# EAGLE design lime2_adapter (EAGLE 6.6.0)
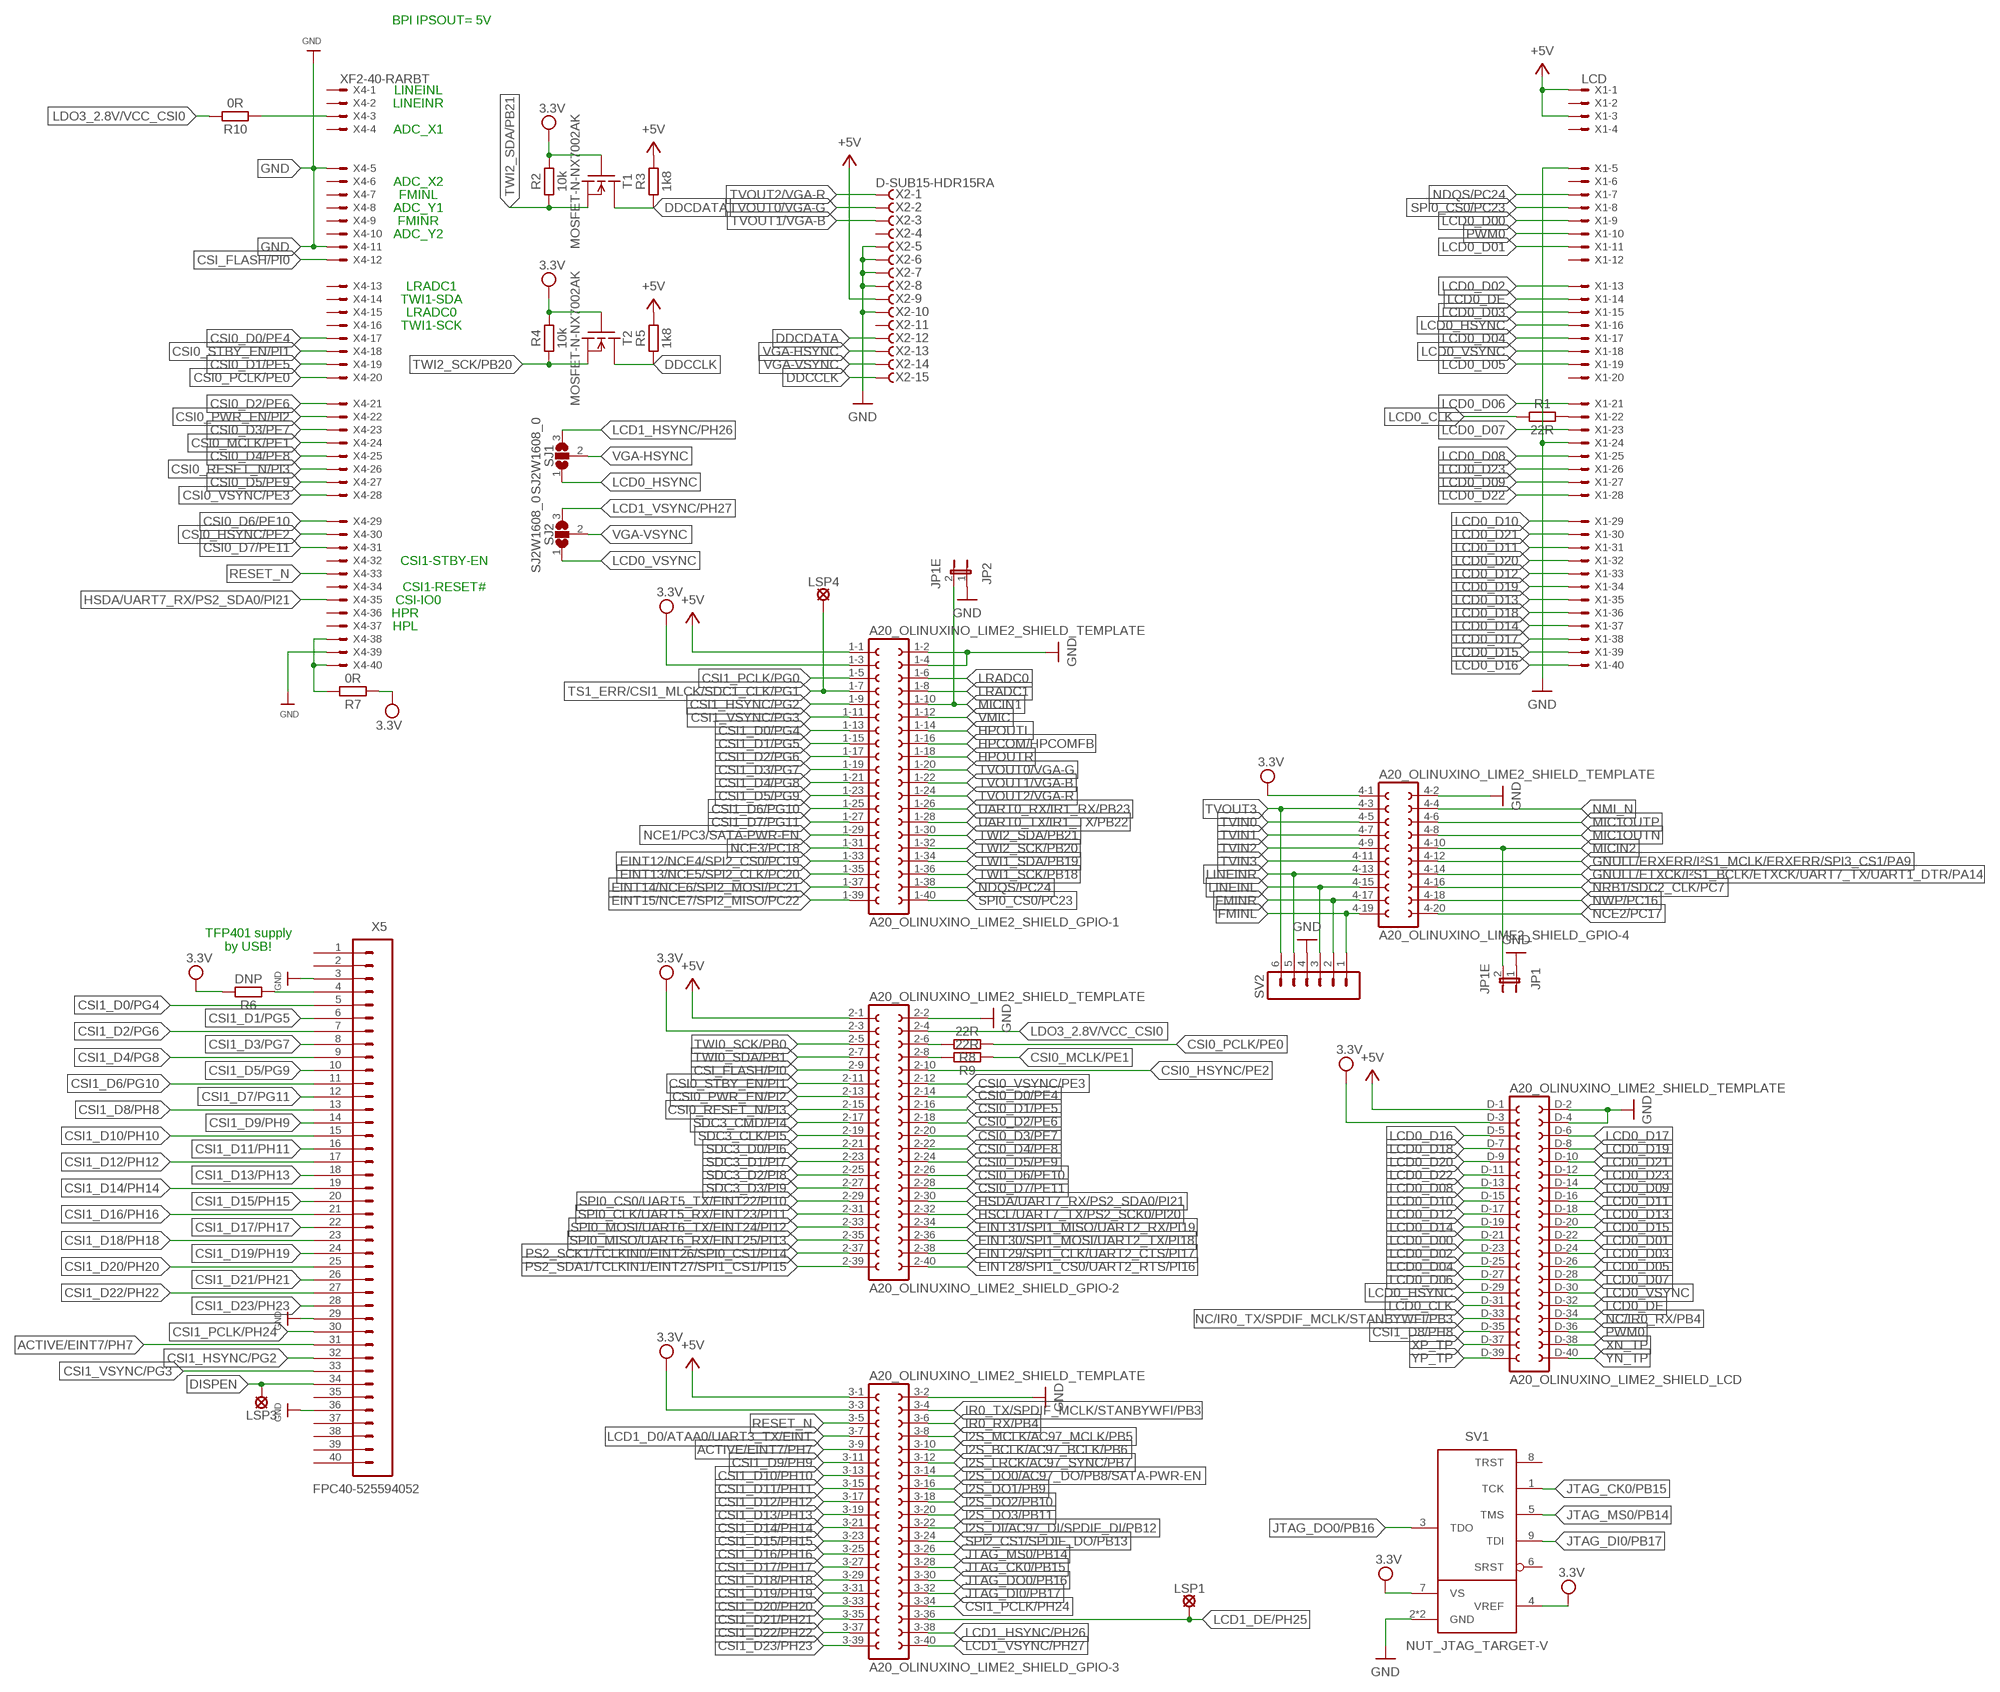
[diagram p0: schematic, sheet 1]

## Parts
A20_OLINUXINO_LIME2_SHIELD  A20_OLINUXINO_LIME2_SHIELD_TEMPLATE  [A20_OLINUXINO_LIME2_SHIELD]
JP1  JP1E  [JP1]
JP2  JP1E  [JP1]
LSP1  LSP-PAD15  [PAD15]
LSP3  LSP-PAD15  [PAD15]
LSP4  LSP-PAD15  [PAD15]
R1  22R  R-EU_RES1608X55N  [RES1608X55N]
R2  10k  R-EU_RES1608X55N  [RES1608X55N]
R3  1k8  R-EU_RES1608X55N  [RES1608X55N]
R4  10k  R-EU_RES1608X55N  [RES1608X55N]
R5  1k8  R-EU_RES1608X55N  [RES1608X55N]
R6  DNP  R-EU_RES1608X55N  [RES1608X55N]
R7  0R  R-EU_RES1608X55N  [RES1608X55N]
R8  22R  R-EU_RES1608X55N  [RES1608X55N]
R9  22R  R-EU_RES1608X55N  [RES1608X55N]
R10  0R  R-EU_RES1608X55N  [RES1608X55N]
SJ1  SJ2W1608_0  [SJ2_1608_0]
SJ2  SJ2W1608_0  [SJ2_1608_0]
SV1  NUT_JTAG_TARGET-V  [ML10]
SV2  MA06-1  [MA06-1]
T1  MOSFET-N-NX7002AK  [SOT95P230X110-3N]
T2  MOSFET-N-NX7002AK  [SOT95P230X110-3N]
X1  LCD  XF2-40-RARBT  [4-1734839-0]
X2  D-SUB15-HDR15RA  [HDR15RA]
X4  XF2-40-RARBT  [4-1734839-0]
X5  FPC40-525594052  [525594052]

## Nets
+5V: A20_OLINUXINO_LIME2_SHIELD.1-1 A20_OLINUXINO_LIME2_SHIELD.2-1 A20_OLINUXINO_LIME2_SHIELD.3-1 A20_OLINUXINO_LIME2_SHIELD.D-1 R3.2 R5.2 X1.1 X1.3 X2.9
ACTIVE/EINT7/PH7: A20_OLINUXINO_LIME2_SHIELD.3-9 X5.31
CSI0_D0/PE4: A20_OLINUXINO_LIME2_SHIELD.2-14 X4.17
CSI0_D1/PE5: A20_OLINUXINO_LIME2_SHIELD.2-16 X4.19
CSI0_D2/PE6: A20_OLINUXINO_LIME2_SHIELD.2-18 X4.21
CSI0_D3/PE7: A20_OLINUXINO_LIME2_SHIELD.2-20 X4.23
CSI0_D4/PE8: A20_OLINUXINO_LIME2_SHIELD.2-22 X4.25
CSI0_D5/PE9: A20_OLINUXINO_LIME2_SHIELD.2-24 X4.27
CSI0_D6/PE10: A20_OLINUXINO_LIME2_SHIELD.2-26 X4.29
CSI0_D7/PE11: A20_OLINUXINO_LIME2_SHIELD.2-28 X4.31
CSI0_HSYNC/PE2: A20_OLINUXINO_LIME2_SHIELD.2-10 X4.30
CSI0_MCLK/PE1: R9.1 X4.24
CSI0_PCLK/PE0: R8.1 X4.20
CSI0_PWR_EN/PI2: A20_OLINUXINO_LIME2_SHIELD.2-13 X4.22
CSI0_RESET_N/PI3: A20_OLINUXINO_LIME2_SHIELD.2-15 X4.26
CSI0_STBY_EN/PI1: A20_OLINUXINO_LIME2_SHIELD.2-11 X4.18
CSI0_VSYNC/PE3: A20_OLINUXINO_LIME2_SHIELD.2-12 X4.28
CSI1_D0/PG4: A20_OLINUXINO_LIME2_SHIELD.1-13 X5.5
CSI1_D1/PG5: A20_OLINUXINO_LIME2_SHIELD.1-15 X5.6
CSI1_D2/PG6: A20_OLINUXINO_LIME2_SHIELD.1-17 X5.7
CSI1_D3/PG7: A20_OLINUXINO_LIME2_SHIELD.1-19 X5.8
CSI1_D4/PG8: A20_OLINUXINO_LIME2_SHIELD.1-21 X5.9
CSI1_D5/PG9: A20_OLINUXINO_LIME2_SHIELD.1-23 X5.10
CSI1_D6/PG10: A20_OLINUXINO_LIME2_SHIELD.1-25 X5.11
CSI1_D7/PG11: A20_OLINUXINO_LIME2_SHIELD.1-27 X5.12
CSI1_D8/PH8: A20_OLINUXINO_LIME2_SHIELD.D-35 X5.13
CSI1_D9/PH9: A20_OLINUXINO_LIME2_SHIELD.3-11 X5.14
CSI1_D10/PH10: A20_OLINUXINO_LIME2_SHIELD.3-13 X5.15
CSI1_D11/PH11: A20_OLINUXINO_LIME2_SHIELD.3-15 X5.16
CSI1_D12/PH12: A20_OLINUXINO_LIME2_SHIELD.3-17 X5.17
CSI1_D13/PH13: A20_OLINUXINO_LIME2_SHIELD.3-19 X5.18
CSI1_D14/PH14: A20_OLINUXINO_LIME2_SHIELD.3-21 X5.19
CSI1_D15/PH15: A20_OLINUXINO_LIME2_SHIELD.3-23 X5.20
CSI1_D16/PH16: A20_OLINUXINO_LIME2_SHIELD.3-25 X5.21
CSI1_D17/PH17: A20_OLINUXINO_LIME2_SHIELD.3-27 X5.22
CSI1_D18/PH18: A20_OLINUXINO_LIME2_SHIELD.3-29 X5.23
CSI1_D19/PH19: A20_OLINUXINO_LIME2_SHIELD.3-31 X5.24
CSI1_D20/PH20: A20_OLINUXINO_LIME2_SHIELD.3-33 X5.25
CSI1_D21/PH21: A20_OLINUXINO_LIME2_SHIELD.3-35 X5.26
CSI1_D22/PH22: A20_OLINUXINO_LIME2_SHIELD.3-37 X5.27
CSI1_D23/PH23: A20_OLINUXINO_LIME2_SHIELD.3-39 X5.28
CSI1_HSYNC/PG2: A20_OLINUXINO_LIME2_SHIELD.1-9 X5.32
CSI1_PCLK/PG0: A20_OLINUXINO_LIME2_SHIELD.1-5
CSI1_PCLK/PH24: A20_OLINUXINO_LIME2_SHIELD.3-34 X5.30
CSI1_VSYNC/PG3: A20_OLINUXINO_LIME2_SHIELD.1-11 X5.33
CSI_FLASH/PI0: A20_OLINUXINO_LIME2_SHIELD.2-9 X4.12
DDCCLK: R5.1 T2.3(D) X2.15
DDCDATA: R3.1 T1.3(D) X2.12
DISPEN: LSP3.MP X5.34
EINT12/NCE4/SPI2_CS0/PC19: A20_OLINUXINO_LIME2_SHIELD.1-33
EINT13/NCE5/SPI2_CLK/PC20: A20_OLINUXINO_LIME2_SHIELD.1-35
EINT14/NCE6/SPI2_MOSI/PC21: A20_OLINUXINO_LIME2_SHIELD.1-37
EINT15/NCE7/SPI2_MISO/PC22: A20_OLINUXINO_LIME2_SHIELD.1-39
EINT28/SPI1_CS0/UART2_RTS/PI16: A20_OLINUXINO_LIME2_SHIELD.2-40
EINT29/SPI1_CLK/UART2_CTS/PI17: A20_OLINUXINO_LIME2_SHIELD.2-38
EINT30/SPI1_MOSI/UART2_TX/PI18: A20_OLINUXINO_LIME2_SHIELD.2-36
EINT31/SPI1_MISO/UART2_RX/PI19: A20_OLINUXINO_LIME2_SHIELD.2-34
FMINL: A20_OLINUXINO_LIME2_SHIELD.4-19 SV2.1
FMINR: A20_OLINUXINO_LIME2_SHIELD.4-17 SV2.2
GND: A20_OLINUXINO_LIME2_SHIELD.1-2 A20_OLINUXINO_LIME2_SHIELD.1-4 A20_OLINUXINO_LIME2_SHIELD.2-2 A20_OLINUXINO_LIME2_SHIELD.3-2 A20_OLINUXINO_LIME2_SHIELD.4-2 A20_OLINUXINO_LIME2_SHIELD.D-2 A20_OLINUXINO_LIME2_SHIELD.D-4 JP1.1 JP2.1 SV1.2(GND) SV1.10(GND) SV2.4 X1.5 X1.24 X2.5 X2.6 X2.7 X2.8 X2.10 X4.5 X4.11 X4.39 X5.3 X5.29 X5.36
GNULL/ERXERR/I²S1_MCLK/ERXERR/SPI3_CS1/PA9: A20_OLINUXINO_LIME2_SHIELD.4-12
GNULL/ETXCK/I²S1_BCLK/ETXCK/UART7_TX/UART1_DTR/PA14: A20_OLINUXINO_LIME2_SHIELD.4-14
HPCOM/HPCOMFB: A20_OLINUXINO_LIME2_SHIELD.1-16
HPOUTL: A20_OLINUXINO_LIME2_SHIELD.1-14
HPOUTR: A20_OLINUXINO_LIME2_SHIELD.1-18
HSCL/UART7_TX/PS2_SCK0/PI20: A20_OLINUXINO_LIME2_SHIELD.2-32
HSDA/UART7_RX/PS2_SDA0/PI21: A20_OLINUXINO_LIME2_SHIELD.2-30 X4.35
I2S_BCLK/AC97_BCLK/PB6: A20_OLINUXINO_LIME2_SHIELD.3-10
I2S_DI/AC97_DI/SPDIF_DI/PB12: A20_OLINUXINO_LIME2_SHIELD.3-22
I2S_DO0/AC97_DO/PB8/SATA-PWR-EN: A20_OLINUXINO_LIME2_SHIELD.3-14
I2S_DO1/PB9: A20_OLINUXINO_LIME2_SHIELD.3-16
I2S_DO2/PB10: A20_OLINUXINO_LIME2_SHIELD.3-18
I2S_DO3/PB11: A20_OLINUXINO_LIME2_SHIELD.3-20
I2S_LRCK/AC97_SYNC/PB7: A20_OLINUXINO_LIME2_SHIELD.3-12
I2S_MCLK/AC97_MCLK/PB5: A20_OLINUXINO_LIME2_SHIELD.3-8
IR0_RX/PB4: A20_OLINUXINO_LIME2_SHIELD.3-6
IR0_TX/SPDIF_MCLK/STANBYWFI/PB3: A20_OLINUXINO_LIME2_SHIELD.3-4
JTAG_CK0/PB15: A20_OLINUXINO_LIME2_SHIELD.3-28 SV1.1(TCK)
JTAG_DI0/PB17: A20_OLINUXINO_LIME2_SHIELD.3-32 SV1.9(TDI)
JTAG_DO0/PB16: A20_OLINUXINO_LIME2_SHIELD.3-30 SV1.3(TDO)
JTAG_MS0/PB14: A20_OLINUXINO_LIME2_SHIELD.3-26 SV1.5(TMS)
LCD0_CLK: A20_OLINUXINO_LIME2_SHIELD.D-31 R1.1
LCD0_CLKR: R1.2 X1.22
LCD0_D00: A20_OLINUXINO_LIME2_SHIELD.D-21 X1.9
LCD0_D01: A20_OLINUXINO_LIME2_SHIELD.D-22 X1.11
LCD0_D02: A20_OLINUXINO_LIME2_SHIELD.D-23 X1.13
LCD0_D03: A20_OLINUXINO_LIME2_SHIELD.D-24 X1.15
LCD0_D04: A20_OLINUXINO_LIME2_SHIELD.D-25 X1.17
LCD0_D05: A20_OLINUXINO_LIME2_SHIELD.D-26 X1.19
LCD0_D06: A20_OLINUXINO_LIME2_SHIELD.D-27 X1.21
LCD0_D07: A20_OLINUXINO_LIME2_SHIELD.D-28 X1.23
LCD0_D08: A20_OLINUXINO_LIME2_SHIELD.D-13 X1.25
LCD0_D09: A20_OLINUXINO_LIME2_SHIELD.D-14 X1.27
LCD0_D10: A20_OLINUXINO_LIME2_SHIELD.D-15 X1.29
LCD0_D11: A20_OLINUXINO_LIME2_SHIELD.D-16 X1.31
LCD0_D12: A20_OLINUXINO_LIME2_SHIELD.D-17 X1.33
LCD0_D13: A20_OLINUXINO_LIME2_SHIELD.D-18 X1.35
LCD0_D14: A20_OLINUXINO_LIME2_SHIELD.D-19 X1.37
LCD0_D15: A20_OLINUXINO_LIME2_SHIELD.D-20 X1.39
LCD0_D16: A20_OLINUXINO_LIME2_SHIELD.D-5 X1.40
LCD0_D17: A20_OLINUXINO_LIME2_SHIELD.D-6 X1.38
LCD0_D18: A20_OLINUXINO_LIME2_SHIELD.D-7 X1.36
LCD0_D19: A20_OLINUXINO_LIME2_SHIELD.D-8 X1.34
LCD0_D20: A20_OLINUXINO_LIME2_SHIELD.D-9 X1.32
LCD0_D21: A20_OLINUXINO_LIME2_SHIELD.D-10 X1.30
LCD0_D22: A20_OLINUXINO_LIME2_SHIELD.D-11 X1.28
LCD0_D23: A20_OLINUXINO_LIME2_SHIELD.D-12 X1.26
LCD0_DE: A20_OLINUXINO_LIME2_SHIELD.D-32 X1.14
LCD0_HSYNC: A20_OLINUXINO_LIME2_SHIELD.D-29 SJ1.1 X1.16
LCD0_VSYNC: A20_OLINUXINO_LIME2_SHIELD.D-30 SJ2.1 X1.18
LCD1_D0/ATAA0/UART3_TX/EINT: A20_OLINUXINO_LIME2_SHIELD.3-7
LCD1_DE/PH25: A20_OLINUXINO_LIME2_SHIELD.3-36 LSP1.MP
LCD1_HSYNC/PH26: A20_OLINUXINO_LIME2_SHIELD.3-38 SJ1.3
LCD1_VSYNC/PH27: A20_OLINUXINO_LIME2_SHIELD.3-40 SJ2.3
LDO3_2.8V/VCC_CSI0: A20_OLINUXINO_LIME2_SHIELD.2-4 R10.2
LINEINL: A20_OLINUXINO_LIME2_SHIELD.4-15 SV2.3
LINEINR: A20_OLINUXINO_LIME2_SHIELD.4-13 SV2.5
LRADC0: A20_OLINUXINO_LIME2_SHIELD.1-6
LRADC1: A20_OLINUXINO_LIME2_SHIELD.1-8
MIC1OUTN: A20_OLINUXINO_LIME2_SHIELD.4-8
MIC1OUTP: A20_OLINUXINO_LIME2_SHIELD.4-6
MICIN1: A20_OLINUXINO_LIME2_SHIELD.1-10 JP2.2
MICIN2: A20_OLINUXINO_LIME2_SHIELD.4-10 JP1.2
N$1: R6.1 X5.4
N$2: R7.2 X4.38 X4.40
N$3: R10.1 X4.3
N$5: A20_OLINUXINO_LIME2_SHIELD.2-6 R8.2
N$9: A20_OLINUXINO_LIME2_SHIELD.2-8 R9.2
NC/IR0_RX/PB4: A20_OLINUXINO_LIME2_SHIELD.D-34
NC/IR0_TX/SPDIF_MCLK/STANBYWFI/PB3: A20_OLINUXINO_LIME2_SHIELD.D-33
NCE1/PC3/SATA-PWR-EN: A20_OLINUXINO_LIME2_SHIELD.1-29
NCE2/PC17: A20_OLINUXINO_LIME2_SHIELD.4-20
NCE3/PC18: A20_OLINUXINO_LIME2_SHIELD.1-31
NDQS/PC24: A20_OLINUXINO_LIME2_SHIELD.1-38 X1.7
NMI_N: A20_OLINUXINO_LIME2_SHIELD.4-4
NRB1/SDC2_CLK/PC7: A20_OLINUXINO_LIME2_SHIELD.4-16
NWP/PC16: A20_OLINUXINO_LIME2_SHIELD.4-18
PS2_SCK1/TCLKIN0/EINT26/SPI0_CS1/PI14: A20_OLINUXINO_LIME2_SHIELD.2-37
PS2_SDA1/TCLKIN1/EINT27/SPI1_CS1/PI15: A20_OLINUXINO_LIME2_SHIELD.2-39
PWM0: A20_OLINUXINO_LIME2_SHIELD.D-36 X1.10
RESET_N: A20_OLINUXINO_LIME2_SHIELD.3-5 X4.33
SDC3_CLK/PI5: A20_OLINUXINO_LIME2_SHIELD.2-19
SDC3_CMD/PI4: A20_OLINUXINO_LIME2_SHIELD.2-17
SDC3_D0/PI6: A20_OLINUXINO_LIME2_SHIELD.2-21
SDC3_D1/PI7: A20_OLINUXINO_LIME2_SHIELD.2-23
SDC3_D2/PI8: A20_OLINUXINO_LIME2_SHIELD.2-25
SDC3_D3/PI9: A20_OLINUXINO_LIME2_SHIELD.2-27
SPI0_CLK/UART5_RX/EINT23/PI11: A20_OLINUXINO_LIME2_SHIELD.2-31
SPI0_CS0/PC23: A20_OLINUXINO_LIME2_SHIELD.1-40 X1.8
SPI0_CS0/UART5_TX/EINT22/PI10: A20_OLINUXINO_LIME2_SHIELD.2-29
SPI0_MISO/UART6_RX/EINT25/PI13: A20_OLINUXINO_LIME2_SHIELD.2-35
SPI0_MOSI/UART6_TX/EINT24/PI12: A20_OLINUXINO_LIME2_SHIELD.2-33
SPI2_CS1/SPDIF_DO/PB13: A20_OLINUXINO_LIME2_SHIELD.3-24
TS1_ERR/CSI1_MLCK/SDC1_CLK/PG1: A20_OLINUXINO_LIME2_SHIELD.1-7 LSP4.MP
TVIN0: A20_OLINUXINO_LIME2_SHIELD.4-5
TVIN1: A20_OLINUXINO_LIME2_SHIELD.4-7
TVIN2: A20_OLINUXINO_LIME2_SHIELD.4-9
TVIN3: A20_OLINUXINO_LIME2_SHIELD.4-11
TVOUT0/VGA-G: A20_OLINUXINO_LIME2_SHIELD.1-20 X2.2
TVOUT1/VGA-B: A20_OLINUXINO_LIME2_SHIELD.1-22 X2.3
TVOUT2/VGA-R: A20_OLINUXINO_LIME2_SHIELD.1-24 X2.1
TVOUT3: A20_OLINUXINO_LIME2_SHIELD.4-3 SV2.6
TWI0_SCK/PB0: A20_OLINUXINO_LIME2_SHIELD.2-5
TWI0_SDA/PB1: A20_OLINUXINO_LIME2_SHIELD.2-7
TWI1_SCK/PB18: A20_OLINUXINO_LIME2_SHIELD.1-36
TWI1_SDA/PB19: A20_OLINUXINO_LIME2_SHIELD.1-34
TWI2_SCK/PB20: A20_OLINUXINO_LIME2_SHIELD.1-32 R4.1 T2.2(S)
TWI2_SDA/PB21: A20_OLINUXINO_LIME2_SHIELD.1-30 R2.1 T1.2(S)
UART0_RX/IR1_RX/PB23: A20_OLINUXINO_LIME2_SHIELD.1-26
UART0_TX/IR1_TX/PB22: A20_OLINUXINO_LIME2_SHIELD.1-28
VCC: A20_OLINUXINO_LIME2_SHIELD.1-3 A20_OLINUXINO_LIME2_SHIELD.2-3 A20_OLINUXINO_LIME2_SHIELD.3-3 A20_OLINUXINO_LIME2_SHIELD.4-1 A20_OLINUXINO_LIME2_SHIELD.D-3 R2.2 R4.2 R6.2 R7.1 SV1.4(VREF) SV1.7(VS) T1.1(G) T2.1(G) ; supply symbol labelled 3.3V
VGA-HSYNC: SJ1.2 X2.13
VGA-VSYNC: SJ2.2 X2.14
VMIC: A20_OLINUXINO_LIME2_SHIELD.1-12
XN_TP: A20_OLINUXINO_LIME2_SHIELD.D-38
XP_TP: A20_OLINUXINO_LIME2_SHIELD.D-37
YN_TP: A20_OLINUXINO_LIME2_SHIELD.D-40
YP_TP: A20_OLINUXINO_LIME2_SHIELD.D-39
Unconnected: SV1.6(SRST) SV1.8(TRST) X1.2 X1.4 X1.6 X1.12 X1.20 X2.4 X2.11 X4.1 X4.2 X4.4 X4.6 X4.7 X4.8 X4.9 X4.10 X4.13 X4.14 X4.15 X4.16 X4.32 X4.34 X4.36 X4.37 X5.1 X5.2 X5.35 X5.37 X5.38 X5.39 X5.40

## Notes on the sheet
- BPI IPSOUT= 5V
- LINEINL
- LINEINR
- ADC_X1
- ADC_X2
- FMINL
- ADC_Y1
- FMINR
- ADC_Y2
- LRADC1
- TWI1-SDA
- LRADC0
- TWI1-SCK
- CSI1-STBY-EN
- CSI1-RESET#
- CSI-IO0
- HPR
- HPL
- TFP401 supply
  by USB!

## Library data of the parts
A20_OLINUXINO_LIME2_SHIELD = A10_OLinuXino_LIME_SHIELD:A20_OLINUXINO_LIME2_SHIELD_TEMPLATE
JP1 JP2 = jumper:JP1E: JUMPER
LSP1 LSP3 LSP4 = solpad:LSP
R1-R10 = rcl:R-EU_: RESISTOR, European symbol
SJ1 SJ2 = jumper:SJ2W: SMD solder JUMPER
SV1 = local:NUT_JTAG_TARGET
SV2 = con-lstb:MA06-1: PIN HEADER; OC_FARNELL: unknown; OC_NEWARK: unknown
T1 T2 = local:MOSFET-N-*?: Generic MOSFET NX7002A?: 60 V, single N-channel Trench MOSFET, 4.5 R @ 10V max, 20 V UGS with Zener, Marking: %CM NX7002B?: 60 V, single N-channel Trench MOSFET, 2.8 R @ 10V, 2.5R @5v (typ) max, 20 V UGS with Zener, Marking: %4R 2N7002(NEX):: 60 V, single N-channel Trench MOSFET, 5 R @ 10V max, 20 V UGS, Marking: 12%
X1 X4 = adafruit:XF2*-40?: OMRON FPC Connector Source : http://www.omron.com/ecb/products/pdf/fpc.pdf XF2M-4015-rev is good for connecting up 'PSP' SHARP LQ043 LCDs
X2 = con-thomas-betts:D-SUB15-: D-Subminiatur Connector Source: Electronioc Interconnects European Edition 1998; OC_FARNELL: unknown; OC_NEWARK: unknown
X5 = local:FPC40-*

## Board
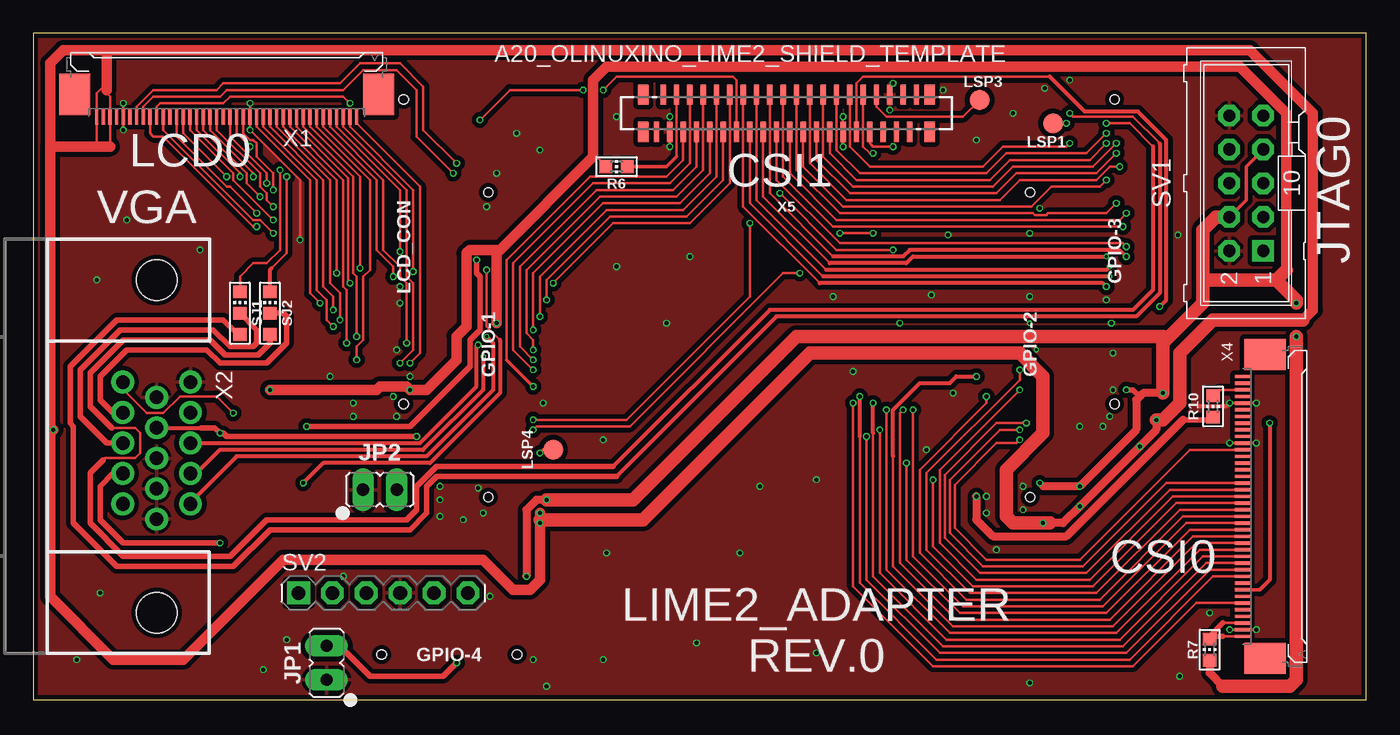
[diagram p1: board, top side]
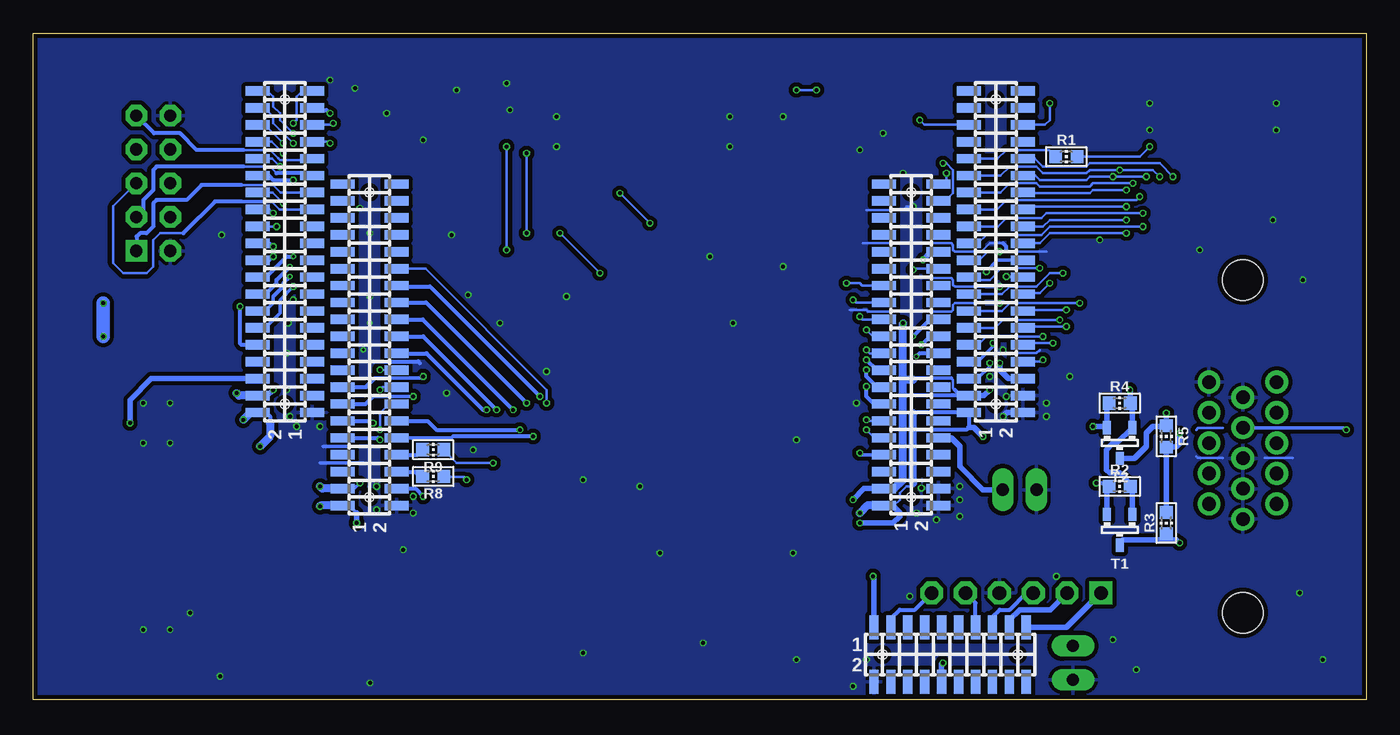
[diagram p2: board, bottom side, seen from below]

Size 100 x 50 mm. Coordinates in mm from the lower left corner, seen from the top.
Outline: 0,0 100,0 100,50 0,50 0,0
Copper layers (1*16): Top 0.035mm / dielectric 1.5mm / Bottom 0.035mm
Design rules "l100_s100_d200_2l *": minimum track width 0.1mm, minimum drill 0.2mm, track to track 0.1mm, track to pad 0.1mm, pad to pad 0.1mm, via to via 0.1mm, smd to smd 0mil, copper to edge 0.34mm, drill to drill 0.4mm, minimum pad ring 0.35mm, minimum via ring 0.1mm, stop-mask expansion 0mil, vias tented up to drill 0.299mm, thermal gap 10mil

### Footprints (pad centres in the part's own frame; a part is rotated, then mirrored left to right if it is on the bottom)
A20_OLINUXINO_LIME2_SHIELD = smd 0.7 x 1.8 bottom: 1-1 -11.874,18.352; 1-2 -11.874,22.416; 1-3 -10.604,18.352; 1-4 -10.604,22.416; 1-5 -9.335,18.352; 1-6 -9.335,22.416; 1-7 -8.065,18.352; 1-8 -8.065,22.416; 1-9 -6.795,18.352; 1-10 -6.795,22.416; 1-11 -5.524,18.352; 1-12 -5.524,22.416; 1-13 -4.255,18.352; 1-14 -4.255,22.416; 1-15 -2.985,18.352; 1-16 -2.985,22.416; 1-17 -1.714,18.352; 1-18 -1.714,22.416; 1-19 -0.445,18.352; 1-20 -0.445,22.416; 1-21 0.826,18.352; 1-22 0.826,22.416; 1-23 2.095,18.352; 1-24 2.095,22.416; 1-25 3.365,18.352; 1-26 3.365,22.416; 1-27 4.636,18.352; 1-28 4.636,22.416; 1-29 5.905,18.352; 1-30 5.905,22.416; 1-31 7.176,18.352; 1-32 7.176,22.416; 1-33 8.445,18.352; 1-34 8.445,22.416; 1-35 9.716,18.352; 1-36 9.716,22.416; 1-37 10.986,18.352; 1-38 10.986,22.416; 1-39 12.255,18.352; 1-40 12.255,22.416; 2-1 -11.874,-22.288; 2-2 -11.874,-18.224; 2-3 -10.604,-22.288; 2-4 -10.604,-18.224; 2-5 -9.335,-22.288; 2-6 -9.335,-18.224; 2-7 -8.065,-22.288; 2-8 -8.065,-18.224; 2-9 -6.795,-22.288; 2-10 -6.795,-18.224; 2-11 -5.524,-22.288; 2-12 -5.524,-18.224; 2-13 -4.255,-22.288; 2-14 -4.255,-18.224; 2-15 -2.985,-22.288; 2-16 -2.985,-18.224; 2-17 -1.714,-22.288; 2-18 -1.714,-18.224; 2-19 -0.445,-22.288; 2-20 -0.445,-18.224; 2-21 0.826,-22.288; 2-22 0.826,-18.224; 2-23 2.095,-22.288; 2-24 2.095,-18.224; 2-25 3.365,-22.288; 2-26 3.365,-18.224; 2-27 4.636,-22.288; 2-28 4.636,-18.224; 2-29 5.905,-22.288; 2-30 5.905,-18.224; 2-31 7.176,-22.288; 2-32 7.176,-18.224; 2-33 8.445,-22.288; 2-34 8.445,-18.224; 2-35 9.716,-22.288; 2-36 9.716,-18.224; 2-37 10.986,-22.288; 2-38 10.986,-18.224; 2-39 12.255,-22.288; 2-40 12.255,-18.224; 3-1 -4.889,-28.639; 3-2 -4.889,-24.575; 3-3 -3.619,-28.639; 3-4 -3.619,-24.575; 3-5 -2.349,-28.639; 3-6 -2.349,-24.575; 3-7 -1.079,-28.639; 3-8 -1.079,-24.575; 3-9 0.191,-28.639; 3-10 0.191,-24.575; 3-11 1.46,-28.639; 3-12 1.46,-24.575; 3-13 2.731,-28.639; 3-14 2.731,-24.575; 3-15 4,-28.639; 3-16 4,-24.575; 3-17 5.271,-28.639; 3-18 5.271,-24.575; 3-19 6.54,-28.639; 3-20 6.54,-24.575; 3-21 7.811,-28.639; 3-22 7.811,-24.575; 3-23 9.081,-28.639; 3-24 9.081,-24.575; 3-25 10.351,-28.639; 3-26 10.351,-24.575; 3-27 11.62,-28.639; 3-28 11.62,-24.575; 3-29 12.89,-28.639; 3-30 12.89,-24.575; 3-31 14.161,-28.639; 3-32 14.161,-24.575; 3-33 15.431,-28.639; 3-34 15.431,-24.575; 3-35 16.701,-28.639; 3-36 16.701,-24.575; 3-37 17.971,-28.639; 3-38 17.971,-24.575; 3-39 19.241,-28.639; 3-40 19.241,-24.575; D-1 -4.889,24.701; D-2 -4.889,28.765; D-3 -3.619,24.701; D-4 -3.619,28.765; D-5 -2.349,24.701; D-6 -2.349,28.765; D-7 -1.079,24.701; D-8 -1.079,28.765; D-9 0.191,24.701; D-10 0.191,28.765; D-11 1.46,24.701; D-12 1.46,28.765; D-13 2.731,24.701; D-14 2.731,28.765; D-15 4,24.701; D-16 4,28.765; D-17 5.271,24.701; D-18 5.271,28.765; D-19 6.54,24.701; D-20 6.54,28.765; D-21 7.811,24.701; D-22 7.811,28.765; D-23 9.081,24.701; D-24 9.081,28.765; D-25 10.351,24.701; D-26 10.351,28.765; D-27 11.62,24.701; D-28 11.62,28.765; D-29 12.89,24.701; D-30 12.89,28.765; D-31 14.161,24.701; D-32 14.161,28.765; D-33 15.431,24.701; D-34 15.431,28.765; D-35 16.701,24.701; D-36 16.701,28.765; D-37 17.971,24.701; D-38 17.971,28.765; D-39 19.241,24.701; D-40 19.241,28.765 | smd 1.8 x 0.7 bottom: 4-1 -21.018,17.59; 4-2 -25.082,17.59; 4-3 -21.018,18.86; 4-4 -25.082,18.86; 4-5 -21.018,20.13; 4-6 -25.082,20.13; 4-7 -21.018,21.399; 4-8 -25.082,21.399; 4-9 -21.018,22.669; 4-10 -25.082,22.669; 4-11 -21.018,23.939; 4-12 -25.082,23.939; 4-13 -21.018,25.209; 4-14 -25.082,25.209; 4-15 -21.018,26.48; 4-16 -25.082,26.48; 4-17 -21.018,27.75; 4-18 -25.082,27.75; 4-19 -21.018,29.02; 4-20 -25.082,29.02 | hole 0.7: -11.239,20.384; 11.62,20.384; -11.239,-20.256; 11.62,-20.256; -4.255,-26.607; 18.605,-26.607; -4.255,26.733; 18.605,26.733; -23.05,18.224; -23.05,28.384
JP1 = drill 0.914 long: 1 0,-1.27; 2 0,1.27
PAD15 = smd 1.5 x 1.5: MP 0,0
RES1608X55N = smd 0.95 x 1: 1 -0.8,0; 2 0.8,0
SJ2_1608_0 = smd 0.95 x 1: 1 -1.6,0; 2 0,0; 3 1.6,0
ML10 = drill 0.914 square: 1 -5.08,-1.27 | drill 0.914 octagon: 2 -5.08,1.27; 3 -2.54,-1.27; 4 -2.54,1.27; 5 0,-1.27; 6 0,1.27; 7 2.54,-1.27; 8 2.54,1.27; 9 5.08,-1.27; 10 5.08,1.27
MA06-1 = drill 1.016 square: 1 -6.35,0 | drill 1.016 octagon: 2 -3.81,0; 3 -1.27,0; 4 1.27,0; 5 3.81,0; 6 6.35,0
SOT95P230X110-3N = smd 0.6 x 1: 1 -0.95,-1.15; 2 0.95,-1.15; 3 0,1.15
4-1734839-0 = smd 0.25 x 1.1: 1 -9.75,-2.54; 2 -9.25,-2.54; 3 -8.75,-2.54; 4 -8.25,-2.54; 5 -7.75,-2.54; 6 -7.25,-2.54; 7 -6.75,-2.54; 8 -6.25,-2.54; 9 -5.75,-2.54; 10 -5.25,-2.54; 11 -4.75,-2.54; 12 -4.25,-2.54; 13 -3.75,-2.54; 14 -3.25,-2.54; 15 -2.75,-2.54; 16 -2.25,-2.54; 17 -1.75,-2.54; 18 -1.25,-2.54; 19 -0.75,-2.54; 20 -0.25,-2.54; 21 0.25,-2.54; 22 0.75,-2.54; 23 1.25,-2.54; 24 1.75,-2.54; 25 2.25,-2.54; 26 2.75,-2.54; 27 3.25,-2.54; 28 3.75,-2.54; 29 4.25,-2.54; 30 4.75,-2.54; 31 5.25,-2.54; 32 5.75,-2.54; 33 6.25,-2.54; 34 6.75,-2.54; 35 7.25,-2.54; 36 7.75,-2.54; 37 8.25,-2.54; 38 8.75,-2.54; 39 9.25,-2.54; 40 9.75,-2.54 | smd 2.3 x 3.1: M1 11.4,-0.84; M2 -11.4,-0.84
HDR15RA = drill 1.016: 1 4.318,2.54; 2 2.032,2.54; 3 -0.254,2.54; 4 -2.54,2.54; 5 -4.826,2.54; 6 5.461,0; 7 3.175,0; 8 0.889,0; 9 -1.397,0; 10 -3.683,0; 11 4.318,-2.54; 12 2.032,-2.54; 13 -0.254,-2.54; 14 -2.54,-2.54; 15 -4.826,-2.54 | hole 3.048: -12.497,0; 12.497,0
525594052 = smd 0.4 x 1.5: 1 -9.75,-1.4; 2 -9.25,1.4; 3 -8.75,-1.4; 4 -8.25,1.4; 5 -7.75,-1.4; 6 -7.25,1.4; 7 -6.75,-1.4; 8 -6.25,1.4; 9 -5.75,-1.4; 10 -5.25,1.4; 11 -4.75,-1.4; 12 -4.25,1.4; 13 -3.75,-1.4; 14 -3.25,1.4; 15 -2.75,-1.4; 16 -2.25,1.4; 17 -1.75,-1.4; 18 -1.25,1.4; 19 -0.75,-1.4; 20 -0.25,1.4; 21 0.25,-1.4; 22 0.75,1.4; 23 1.25,-1.4; 24 1.75,1.4; 25 2.25,-1.4; 26 2.75,1.4; 27 3.25,-1.4; 28 3.75,1.4; 29 4.25,-1.4; 30 4.75,1.4; 31 5.25,-1.4; 32 5.75,1.4; 33 6.25,-1.4; 34 6.75,1.4; 35 7.25,-1.4; 36 7.75,1.4; 37 8.25,-1.4; 38 8.75,1.4; 39 9.25,-1.4; 40 9.75,1.4 | smd 0.8 x 1.5: S1 10.75,1.4; S2 -10.75,1.4; S3 -10.75,-1.4; S4 10.75,-1.4

### Placement (x,y rotation side)
A20_OLINUXINO_LIME2_SHIELD  54.52,26.43 90 top
JP1  22,2.75 0 top
JP2  26,15.75 270 top
LSP1  76.5,43.25 90 top
LSP3  71,45 90 top
LSP4  39,18.75 90 top
R1  22.5,40.75 0 bottom
R2  18.5,16 0 bottom
R3  15,13.25 90 bottom
R4  18.5,22.25 0 bottom
R5  15,19.75 270 bottom
R6  43.75,40 180 top
R7  88.25,3.75 90 top
R8  70,16.75 180 bottom
R9  70,18.75 180 bottom
R10  88.5,22 270 top
SJ1  15.5,29 270 top
SJ2  17.75,29 270 top
SV1  91,38.75 90 top
SV2  26.25,8 0 top
T1  18.5,12.75 180 bottom
T2  18.5,19.25 180 bottom
X1  14.5,46.25 0 top
X2  9.25,19 270 top
X4  93.25,14.5 270 top
X5  56.5,44 0 top

### Tracks (layer width: path | path; a pad name or v marks a point on that pad's centre or on a via)
+5V  (via drill 0.3)
  Top 0.2: 4.75,41.5 X1.1 4.75,45.5 5.25,46 | 5.75,41.5 X1.3 5.75,45.25 5.25,45.75
  Top 0.3: X2.9 12.6,20.4
  Top 0.4: v28.75,19.75 14.5,19.75 14.25,20 v14,20 13.6,20.4 12.6,20.4
  Top 0.6: v84.25,21 84.25,20.25 v83,19 v78.5,14.5 77.25,13.25 76.25,13.25 | 76,13.25 v75.75,13.25
  Top 0.8: 95.25,28.5 96,29.25 96,44 91.25,48.75 5.5,48.75 | 5.5,45.75 5.5,48.75 | 5.5,48.75 2.25,48.75 1.25,47.75 1.25,41.5 | 1.25,41.5 4.75,41.5 5.75,41.5 | v38,14 38,13.5 v38,13.25 38,9 37.25,8.25 36,8.25 33.75,10.5 18.75,10.5 11.25,3 6,3 1.25,7.75 1.25,20.25 | v1.5,20.25 1.25,20.25 | 1.25,20.25 1.25,41.5
  Top 1: v84.25,21 84.75,21 86,22.25 86,26 88.5,28.5 95.25,28.5 | 38,13.5 45.75,13.5 58.25,26 74,26 75.75,24.25 75.75,20 73,17.25 73,13.75 73.5,13.25 76,13.25 76.25,13.25
  Bottom 0.2: A20_OLINUXINO_LIME2_SHIELD.1-1 35.91,14.56 35.44,14.56 35,15 35,15.5 34.5,16 34.25,16 34,16.25
  Bottom 0.25: X2.9 1.65,20.4 v1.5,20.25 | A20_OLINUXINO_LIME2_SHIELD.2-1 76.31,14.56 75.75,14
  Bottom 0.3: 34,21.5 33.96,21.54 A20_OLINUXINO_LIME2_SHIELD.D-1 29.82,20.43 30,20.25 34,20.25 | A20_OLINUXINO_LIME2_SHIELD.3-1 82.54,21.54 82.25,21.25 82.25,20.75
  Bottom 0.4: 29.82,20.43 29.43,20.43 v28.75,19.75 | R3.2 R5.2 14.3,18.95 14,19.25 v14,20 | 75.75,14 v75.75,13.25 | 35.91,14.56 35.56,14.56 35,14 35,13.75 35.5,13.25 v38,13.25
  Bottom 0.6: 34,16.25 34,20.25 34,21.5 | A20_OLINUXINO_LIME2_SHIELD.3-1 83.71,21.54 v84.25,21 | A20_OLINUXINO_LIME2_SHIELD.1-1 37.44,14.56 v38,14 | A20_OLINUXINO_LIME2_SHIELD.2-1 78.44,14.56 v78.5,14.5 | 82.25,20.75 82.25,19.75 v83,19
ACTIVE/EINT7/PH7  (via drill 0.3)
  Top 0.2: X5.31 61.75,46.25 62.25,46.75 76.25,46.75
  Top 0.3: v84.5,29.5 85,30 85,42 82.88,44.12 78.88,44.12 76.25,46.75
  Bottom 0.3: A20_OLINUXINO_LIME2_SHIELD.3-9 84.37,26.62 84.5,26.75 v84.5,29.5
CSI0_D0/PE4  (via drill 0.3)
  Top 0.2: X4.17 85,16.25 78.75,10 71.25,10 68.75,12.5 68.75,16.5 72.5,20.25 v74,20.25
  Bottom 0.2: A20_OLINUXINO_LIME2_SHIELD.2-14 73.33,22.18 74,21.5 v74,20.25
CSI0_D1/PE5  (via drill 0.3)
  Top 0.2: X4.19 85.5,15.25 79.25,9 70.75,9 68,11.75 68,17.25 v74,23.25
  Bottom 0.2: A20_OLINUXINO_LIME2_SHIELD.2-16 73.81,23.45 v74,23.25
CSI0_D2/PE6  (via drill 0.3)
  Top 0.2: X4.21 86,14.25 79.75,8 70.25,8 67,11.25 67,17 74,24 v74,24.75
  Bottom 0.2: A20_OLINUXINO_LIME2_SHIELD.2-18 73.97,24.71 v74,24.75
CSI0_D3/PE7  (via drill 0.3)
  Top 0.2: X4.23 86.5,13.25 80.25,7 69.75,7 66,10.75 v66,21.75
  Bottom 0.3: A20_OLINUXINO_LIME2_SHIELD.2-20 70.49,25.98 | 70.49,25.98 70.5,26 | 70.49,25.98 66.25,21.75 v66,21.75
CSI0_D4/PE8  (via drill 0.3)
  Top 0.2: X4.25 87,12.25 80.75,6 69.25,6 65,10.25 65,21.5 v65.25,21.75
  Bottom 0.3: A20_OLINUXINO_LIME2_SHIELD.2-22 70.75,27.26 v65.25,21.75
CSI0_D5/PE9  (via drill 0.3)
  Top 0.2: X4.27 87.5,11.25 81.25,5 68.75,5 64,9.75 v64,21.75
  Bottom 0.3: A20_OLINUXINO_LIME2_SHIELD.2-24 70.78,28.53 v64,21.75
CSI0_D6/PE10  (via drill 0.3)
  Top 0.2: X4.29 88,10.25 81.75,4 68.25,4 63,9.25 63,20
  Top 0.3: 63,20 v63,22.25
  Bottom 0.3: A20_OLINUXINO_LIME2_SHIELD.2-26 70.55,29.8 v63,22.25
CSI0_D7/PE11  (via drill 0.3)
  Top 0.2: X4.31 88.5,9.25 82.25,3 67.75,3 62,8.75 62,19.75
  Top 0.3: 62,19.75 v62,22.75
  Bottom 0.3: A20_OLINUXINO_LIME2_SHIELD.2-28 72.57,31.07 72.5,31 70.25,31 v62,22.75
CSI0_HSYNC/PE2  (via drill 0.3)
  Top 0.2: X4.30 88.25,9.75 82,3.5 68,3.5 62.5,9 v62.5,19.75
  Bottom 0.25: A20_OLINUXINO_LIME2_SHIELD.2-10 68.61,19.64 68.5,19.75
  Bottom 0.3: v62.5,19.75 68.5,19.75
CSI0_MCLK/PE1  (via drill 0.3)
  Top 0.2: X4.24 86.75,12.75 80.5,6.5 69.5,6.5 65.5,10.5 v65.5,17.75
  Bottom 0.2: R9.1 69.2,18.7 68.25,17.75 v65.5,17.75
CSI0_PCLK/PE0  (via drill 0.3)
  Top 0.2: X4.20 85.75,14.75 79.5,8.5 70.5,8.5 67.5,11.5 v67.5,16.5
  Bottom 0.2: R8.1 69.2,16.7 67.7,16.7 v67.5,16.5
CSI0_PWR_EN/PI2  (via drill 0.3)
  Top 0.2: X4.22 86.25,13.75 80,7.5 70,7.5 66.5,11 66.5,17.25 71.5,22.25 v71.5,22.75
  Bottom 0.25: 74.5,22.75 v71.5,22.75
  Bottom 0.3: A20_OLINUXINO_LIME2_SHIELD.2-13 75.08,22.18 74.5,22.75
CSI0_RESET_N/PI3  (via drill 0.3)
  Top 0.2: X4.26 87.25,11.75 81,5.5 69,5.5 64.5,10 64.5,18.25
  Top 0.3: 64.5,18.25 64.5,21.75 66.5,23.75 68.75,23.75 69.25,24.25 v70.75,24.25
  Bottom 0.25: 74.38,24.12 70.88,24.12 v70.75,24.25
  Bottom 0.3: A20_OLINUXINO_LIME2_SHIELD.2-15 75.06,23.45 74.38,24.12
CSI0_STBY_EN/PI1  (via drill 0.3)
  Top 0.2: X4.18 85.25,15.75 79,9.5 71,9.5 68.38,12.12 68.38,16.88 72.25,20.75 v74.5,20.75
  Bottom 0.3: A20_OLINUXINO_LIME2_SHIELD.2-11 74.66,20.91 v74.5,20.75
CSI0_VSYNC/PE3  (via drill 0.3)
  Top 0.2: X4.28 87.75,10.75 81.5,4.5 68.5,4.5 63.5,9.5 v63.5,20.25
  Bottom 0.3: A20_OLINUXINO_LIME2_SHIELD.2-12 70.41,20.91 69.75,20.25 v63.5,20.25
CSI1_D0/PG4  (via drill 0.3)
  Top 0.2: 35.5,25.5 35.5,33 41.75,39.25 47.5,39.25 48.75,40.5 X5.5
  Top 0.25: 35.5,25.5 v37.5,23.5
  Bottom 0.25: A20_OLINUXINO_LIME2_SHIELD.1-13 36.67,22.18
  Bottom 0.3: 36.67,22.18 36.92,22.18 37.5,22.75 v37.5,23.5
CSI1_D1/PG5  (via drill 0.3)
  Top 0.2: v37.5,24.75 36,26.25 36,32.75 42,38.75 47.75,38.75 49.25,40.25 X5.6
  Bottom 0.3: A20_OLINUXINO_LIME2_SHIELD.1-15 36.7,23.45 37.5,24.25 v37.5,24.75
CSI1_D2/PG6  (via drill 0.3)
  Top 0.2: v37.5,25.5 36.5,26.5 36.5,32.5 42.25,38.25 48,38.25 49.75,40 X5.7
  Bottom 0.3: A20_OLINUXINO_LIME2_SHIELD.1-17 36.72,24.71 v37.5,25.5
CSI1_D3/PG7  (via drill 0.3)
  Top 0.2: v37.5,26.25 37.5,27 37,27.5 37,32.25 42.5,37.75 48.25,37.75 50.25,39.75 X5.8
  Bottom 0.2: A20_OLINUXINO_LIME2_SHIELD.1-19 37.24,25.98 v37.5,26.25
CSI1_D4/PG8  (via drill 0.3)
  Top 0.2: v37.5,27.75 37.5,32 42.75,37.25 48.5,37.25 50.75,39.5 X5.9
  Bottom 0.2: A20_OLINUXINO_LIME2_SHIELD.1-21 37.01,27.26 v37.5,27.75
CSI1_D5/PG9  (via drill 0.3)
  Top 0.2: v38,28.75 38,31.75 43,36.75 48.75,36.75 51.25,39.25 X5.10
  Bottom 0.2: A20_OLINUXINO_LIME2_SHIELD.1-23 37.78,28.53 v38,28.75
CSI1_D6/PG10  (via drill 0.3)
  Top 0.2: v38.5,30 38.5,31.5 43.25,36.25 49,36.25 51.75,39 X5.11
  Bottom 0.2: A20_OLINUXINO_LIME2_SHIELD.1-25 38.3,29.8 v38.5,30
CSI1_D7/PG11  (via drill 0.3)
  Top 0.2: v39,31.25 43.5,35.75 49.25,35.75 52.25,38.75 X5.12
  Bottom 0.2: A20_OLINUXINO_LIME2_SHIELD.1-27 37.82,31.07 38,31.25 v39,31.25
CSI1_D8/PH8  (via drill 0.3)
  Top 0.2: v42.75,45.75 43.75,46.75 52.5,46.75 52.75,46.5 X5.13 | v33.5,43.5 35.75,45.75 v41.25,45.75
  Bottom 0.2: v42.75,45.75 v41.25,45.75 | A20_OLINUXINO_LIME2_SHIELD.D-35 33.13,43.13 v33.5,43.5
CSI1_D9/PH9  (via drill 0.3)
  Top 0.2: 59,31.25 53.25,37 X5.14
  Top 0.3: 59,31.25 80.25,31.25 v80.5,31
  Bottom 0.2: A20_OLINUXINO_LIME2_SHIELD.3-11 82.61,27.89
  Bottom 0.25: 82.61,27.89 81.5,29 81.5,30 v80.5,31
CSI1_D10/PH10  (via drill 0.2)
  Top 0.2: 59.25,31.75 53.75,37.25 X5.15
  Top 0.25: 80.5,31.75 v80.75,31.75
  Top 0.3: 80.5,31.75 59.25,31.75
  Bottom 0.25: A20_OLINUXINO_LIME2_SHIELD.3-13 82.59,29.16 82,29.75 82,30.25
  Bottom 0.3: v80.75,31.75 81.25,31.25 81.25,31 82,30.25
CSI1_D11/PH11  (via drill 0.2)
  Top 0.2: 59.5,32.25 54.25,37.5 X5.16
  Top 0.3: 59.5,32.25 80.5,32.25 v80.75,32.5
  Bottom 0.3: A20_OLINUXINO_LIME2_SHIELD.3-15 82.57,30.43 81.75,31.25 81.75,31.5 v80.75,32.5
CSI1_D12/PH12  (via drill 0.2)
  Top 0.2: 59.75,32.75 54.75,37.75 X5.17
  Top 0.3: 59.75,32.75 65.5,32.75 66,33.25 v80.5,33.25
  Bottom 0.3: A20_OLINUXINO_LIME2_SHIELD.3-17 82.55,31.7 81,33.25 v80.5,33.25
CSI1_D13/PH13  (via drill 0.3)
  Top 0.2: 60,33.25 55.25,38 X5.18
  Top 0.25: 81,33.75 81.5,33.75 v82,33.25
  Top 0.3: 81,33.75 65.75,33.75 65.25,33.25 60,33.25
  Bottom 0.25: A20_OLINUXINO_LIME2_SHIELD.3-19 82.28,32.97 v82,33.25
CSI1_D14/PH14  (via drill 0.3)
  Top 0.2: v82,34 81.75,34.25 60.5,34.25 55.75,39 X5.19
  Bottom 0.2: v82.01,33.99 v82,34 82.24,34.24 A20_OLINUXINO_LIME2_SHIELD.3-21
CSI1_D15/PH15  (via drill 0.3)
  Top 0.2: v81.75,35.5 60,35.5 56.25,39.25 X5.20
  Bottom 0.2: A20_OLINUXINO_LIME2_SHIELD.3-23 81.76,35.51 v81.75,35.5
CSI1_D16/PH16  (via drill 0.3)
  Top 0.2: v82,36.5 81.5,36 60.25,36 56.75,39.5 X5.21
  Bottom 0.2: A20_OLINUXINO_LIME2_SHIELD.3-25 82.28,36.78 v82,36.5
CSI1_D17/PH17  (via drill 0.3)
  Top 0.2: v81.25,37.25 80.5,36.5 76.12,36.5 76,36.38 75.12,36.38 75,36.5 60.5,36.5 57.25,39.75 X5.22
  Bottom 0.2: A20_OLINUXINO_LIME2_SHIELD.3-27 82.05,38.05 v81.25,37.25
CSI1_D18/PH18  (via drill 0.3)
  Top 0.2: v80.5,39 80,38.5 76.38,38.5 74.88,37 60.75,37 57.75,40 X5.23
  Bottom 0.3: A20_OLINUXINO_LIME2_SHIELD.3-29 82.32,39.32 82,39 v80.5,39
CSI1_D19/PH19  (via drill 0.3)
  Top 0.2: v81.5,40 80.75,40 79.75,39 74,39 72.5,37.5 61,37.5 58.25,40.25 X5.24
  Bottom 0.2: A20_OLINUXINO_LIME2_SHIELD.3-31 82.09,40.59 v81.5,40
CSI1_D20/PH20  (via drill 0.3)
  Top 0.2: v81.25,41 79.75,39.5 73.75,39.5 72.25,38 61.25,38 58.75,40.5 X5.25
  Bottom 0.2: A20_OLINUXINO_LIME2_SHIELD.3-33 82.11,41.86 v81.25,41
CSI1_D21/PH21  (via drill 0.3)
  Top 0.2: v81.25,41.75 79.5,40 73.5,40 72,38.5 61.5,38.5 59.25,40.75 X5.26
  Bottom 0.2: A20_OLINUXINO_LIME2_SHIELD.3-35 82.63,43.13 v81.25,41.75
CSI1_D22/PH22  (via drill 0.3)
  Top 0.2: v80.5,41.75 79.25,40.5 73.25,40.5 71.75,39 61.75,39 59.75,41 X5.27
  Bottom 0.2: v80.5,41.75 82,43.25 82,43.75 82.65,44.4 A20_OLINUXINO_LIME2_SHIELD.3-37
CSI1_D23/PH23  (via drill 0.3)
  Top 0.2: v80.5,42.5 79,41 73,41 71.5,39.5 62,39.5 60.25,41.25 X5.28
  Bottom 0.2: A20_OLINUXINO_LIME2_SHIELD.3-39 82.42,45.67 82,45.25 82,44.5 81.5,44 81.5,43.5 v80.5,42.5
CSI1_HSYNC/PG2  (via drill 0.3)
  Top 0.2: v63,41 62.75,41 62.25,41.5 X5.32 | v63,35 v60.5,35 | v37.5,20.25 37.75,20.5 44.75,20.5 56.25,32 v57.5,32
  Bottom 0.2: v63,41 v63,35 | v60.5,35 v57.5,32 | A20_OLINUXINO_LIME2_SHIELD.1-9 36.89,19.64 v37.5,20.25
CSI1_PCLK/PH24  (via drill 0.3)
  Top 0.2: v77.75,41.75 77.5,41.5 72.75,41.5 71.25,40 62.75,40 61.25,41.5 X5.30
  Bottom 0.2: A20_OLINUXINO_LIME2_SHIELD.3-34 77.86,41.86 v77.75,41.75
CSI1_VSYNC/PG3  (via drill 0.3)
  Top 0.2: v64.5,41.5 63,41.5 62.75,41.75 X5.33 | v64.5,33.75 60.25,33.75 v56,38 | v37.5,21 44.5,21 53.75,30.25 v53.75,35.75
  Bottom 0.2: v64.5,41.5 v64.5,33.75 | v56,38 v53.75,35.75 | A20_OLINUXINO_LIME2_SHIELD.1-11 37.41,20.91 v37.5,21
CSI_FLASH/PI0  (via drill 0.3)
  Top 0.2: X4.12 86.75,18.75 78.5,10.5 71.5,10.5 69.12,12.88 69.12,16.12 72.25,19.25 73.75,19.25 v74,19.5
  Bottom 0.3: A20_OLINUXINO_LIME2_SHIELD.2-9 74.14,19.64 v74,19.5
DDCCLK  (via drill 0.3)
  Top 0.2: X2.15 6.71,23.29 8.5,21.5 9.75,21.5 11,22.75 13.75,22.75 v15,21.5
  Bottom 0.4: T2.3 17.4,18.1 16.5,19 16.5,20 16,20.5 15.05,20.5 R5.1 v15,21.5
DDCDATA  (via drill 0.3)
  Top 0.4: X2.12 5.97,16.97 5,16 5,13.5 6.75,11.75 v14,11.75
  Bottom 0.4: T1.3 18.5,11.75 18.25,12 15,12 | 15,12 14.25,12 v14,11.75 | R3.1 15,12
DISPEN
  Top 0.2: X5.34 63.25,44.5 64,43.75 69.75,43.75 LSP3.MP
FMINL
  Bottom 0.4: A20_OLINUXINO_LIME2_SHIELD.4-19 22.49,5.41 SV2.1
FMINR
  Bottom 0.4: A20_OLINUXINO_LIME2_SHIELD.4-17 26.77,5.98 26,6.75 23.69,6.75 SV2.2
GND  (via drill 0.2, 0.3)
  Top 0.2: v6.75,44.75 X1.5 v6.75,42.75 | v16.25,44.75 X1.24 v16.25,42.75 20,39 v20,34.5 | v89.75,22.25 X4.5 v91.75,22.25 | v89.75,19.25 X4.11 v91.75,19.25 | v91.75,5.25 X4.39 v89.75,5.25 | X5.3 v47.75,41.5 | v60.75,41.5 X5.29 v60.75,43.75 | X5.36 64.25,46 v64.5,46.25
  Top 0.3: v89.75,22.25 89.5,22 87.5,22
  Bottom 0.2: 24,33.62 26.88,33.62 27,33.75 | 27.25,34.25 28.25,34.25 28.88,33.62 30.88,33.62 31,33.75 31,34.12 31.12,34.25 37.75,34.25 | 7.62,18.12 5.5,18.12 | 10.75,18.12 12.62,18.12 12.75,18.25 | v27.5,29.75 30.88,29.75 31,29.62 31,29.25 31.12,29.12 37.38,29.12 37.5,29.25 38.75,29.25 | v34,37 34.5,37 34.75,36.75 37.5,36.75 | v27.5,31 30.88,31 31,31.12 31,31.5 31.12,31.62 33.5,31.62 | 24.5,26.25 24.75,26 27,26 v27.25,26.25
  Bottom 0.25: 75.25,17.75 78.5,17.75 | 75.5,19 78.25,19
  Bottom 0.3: 27,33.75 27,34 27.25,34.25 | 74.5,25.38 71.12,25.38 71,25.25
  Bottom 0.4: A20_OLINUXINO_LIME2_SHIELD.D-2 26.96,21.54 v27.25,21.25
  other vias: 22.25,24.25 24,22.25 27,22.75 28.25,24.25 33.75,14 32.25,13.5 78.5,20.5 80.25,20.5 80.75,21.25 71.5,15.25 71.5,14 74.25,14.25 74.25,16 81,23.25 34.75,39.5 75.25,26.25 74.75,30.25 60,30.25 74.75,35 68.62,34.88 58.75,16.5 69,23 80.5,30 81,26 75.88,45.88 75.5,36.88 47.75,43.75 64.25,44.25 85.88,34.88 77.75,46.5 73.5,44 67,18.75 38.25,22.25 49.25,33.25 42.75,19.5 7,36 12.5,33.75 4.75,31.5 5,8 3.25,3 17.25,2.25 19,4.5 23.25,9.25 42.75,3 43,11 58.75,3.5 49.75,4.25 53,11 54.5,16 47.5,28.25 43.75,32.5 36.25,42.5 38,41.25 43.75,43.75 70.75,42 68.25,45.75 74.75,1.25 86,1.75 88.25,6.5 30.5,13.75 24,21.25 72.25,11.25 37.5,3 38.5,1 30.5,15 30.5,16 33.38,15.88 34.25,7.75 80.88,28.25 74.75,28.25 65,28.25 67.38,30.38 61.5,24.62
  pour Bottom (isolate 0.31): 100,0 100,50 0,50 0,0
  pour Top (isolate 0.35): 100,0 100,50 0,50 0,0
HSDA/UART7_RX/PS2_SDA0/PI21  (via drill 0.3)
  Top 0.2: X4.35 87.25,7.25 82.5,2.5 67.5,2.5 61.5,8.5 v61.5,22.25
  Bottom 0.2: v61.5,22.25 61.5,23.25 70.58,32.34 A20_OLINUXINO_LIME2_SHIELD.2-30
JTAG_CK0/PB15
  Bottom 0.2: A20_OLINUXINO_LIME2_SHIELD.3-28 81.42,38.05 82,38.62 84.38,38.62
  Bottom 0.3: 84.38,38.62 87.38,38.62 88.5,37.5 90.75,37.5 91,37.25 91,35.5 91.5,35 92,35 92.25,34.75 92.25,33.69 SV1.1
JTAG_DI0/PB17
  Bottom 0.2: 84.25,41.25 82.25,41.25 81.62,40.62 81.59,40.59 81.5,40.5 79.75,40.5 79.66,40.59 A20_OLINUXINO_LIME2_SHIELD.3-32
  Bottom 0.3: 84.25,41.25 87.75,41.25 89,42.5 90.94,42.5 SV1.9
JTAG_DO0/PB16
  Bottom 0.2: 81.75,39.5 82.25,40 84.25,40
  Bottom 0.3: 84.25,40 90.75,40 91,39.75 91,38.25 91.75,37.5 91.75,36.73 SV1.3 | A20_OLINUXINO_LIME2_SHIELD.3-30 79.57,39.32 79.75,39.5 81.75,39.5
JTAG_MS0/PB14
  Bottom 0.2: A20_OLINUXINO_LIME2_SHIELD.3-26 81.53,36.78 82.12,37.38 | SV1.5 94,37.02 94,32.75 93.25,32 91.5,32 91,32.5 91,34.5 90.5,35 88.75,35
  Bottom 0.25: 82.12,37.38 84.38,37.38
  Bottom 0.3: 88.75,35 86.38,37.38 84.38,37.38
LCD0_CLK
  Bottom 0.2: A20_OLINUXINO_LIME2_SHIELD.D-31 27.66,40.59 27,41.25 23.8,41.25 R1.1
LCD0_CLKR  (via drill 0.3)
  Top 0.2: X1.22 15.25,42.5 v16.25,41.5
  Bottom 0.2: R1.2 17,40.75 v16.25,41.5
LCD0_D00  (via drill 0.3)
  Top 0.2: v16.75,35.5 16.5,35.5 9.75,42.25 9,42.25 8.75,42.5 X1.9
  Bottom 0.2: A20_OLINUXINO_LIME2_SHIELD.D-21 29.24,34.24 | v16.75,35.5 23.75,35.5 24.38,34.88 28.5,34.88 29.12,34.25 29.25,34.25 29.24,34.24 | 29.13,34.24 29.24,34.24
LCD0_D01  (via drill 0.3)
  Top 0.2: v18,35 17,36 16.5,36 9.75,42.75 X1.11
  Bottom 0.2: A20_OLINUXINO_LIME2_SHIELD.D-22 25.51,34.24 25.5,34.25 24.5,34.25 23.75,35 v18,35
LCD0_D02  (via drill 0.3)
  Top 0.2: v16.75,36.5 14.75,38.5 14.5,38.5 10.75,42.25 X1.13
  Bottom 0.2: v16.75,36.5 24,36.5 24.38,36.12 27,36.12 27.61,35.51 A20_OLINUXINO_LIME2_SHIELD.D-23
LCD0_D03  (via drill 0.3)
  Top 0.2: v18,36 15,39 15,39.5 11.75,42.75 X1.15
  Bottom 0.2: A20_OLINUXINO_LIME2_SHIELD.D-24 24.24,35.51 23.75,36 v18,36
LCD0_D04  (via drill 0.3)
  Top 0.2: v17,37.75 16,38.75 16,39.5 12.75,42.75 X1.17
  Bottom 0.2: A20_OLINUXINO_LIME2_SHIELD.D-25 27.72,36.78 27,37.5 17.25,37.5 v17,37.75
LCD0_D05  (via drill 0.3)
  Top 0.2: v18,37 17.5,37.5 17.5,38 17,38.5 17,39.5 13.75,42.75 X1.19
  Bottom 0.2: A20_OLINUXINO_LIME2_SHIELD.D-26 25.72,36.78 25.5,37 v18,37
LCD0_D06  (via drill 0.3)
  Top 0.2: v17.5,38.75 17.5,39.5 14.75,42.25 X1.21
  Bottom 0.2: v17.5,38.75 20.5,38.75 20.75,38.5 24.5,38.5 24.75,38.75 26.75,38.75 27.45,38.05 A20_OLINUXINO_LIME2_SHIELD.D-27
LCD0_D07  (via drill 0.3)
  Top 0.2: v18,38.25 18,39.5 16.75,40.75 16.75,41.75 16.5,42 16.25,42 15.75,42.5 X1.23
  Bottom 0.2: A20_OLINUXINO_LIME2_SHIELD.D-28 25.75,38.01 25.75,38 20.75,38 20.5,38.25 v18,38.25
LCD0_D08  (via drill 0.3)
  Top 0.2: v21.5,29.75 20.75,30.5 20.75,39 16.75,43 X1.25
  Bottom 0.2: A20_OLINUXINO_LIME2_SHIELD.D-13 27.34,29.16 26.75,29.75 v21.5,29.75
LCD0_D09  (via drill 0.3)
  Top 0.2: v22.5,29.25 22.5,30.25 21.75,31 21.75,39 17.75,43 X1.27
  Bottom 0.2: A20_OLINUXINO_LIME2_SHIELD.D-14 25.34,29.16 25.25,29.25 v22.5,29.25
LCD0_D10  (via drill 0.3)
  Top 0.2: v22.75,32 22.75,39 18.75,43 X1.29
  Bottom 0.2: A20_OLINUXINO_LIME2_SHIELD.D-15 27.32,30.43 26.75,31 24.75,31 23.75,32 v22.75,32
LCD0_D11  (via drill 0.3)
  Top 0.2: v23.75,31.25 23.62,31.38 23.62,39.12 19.75,43 X1.31
  Bottom 0.2: A20_OLINUXINO_LIME2_SHIELD.D-16 25.57,30.43 25.5,30.5 24.5,30.5 v23.75,31.25
LCD0_D12  (via drill 0.3)
  Top 0.2: v24.5,32.38 24.5,39.25 20.75,43 X1.33
  Bottom 0.2: v24.5,32.38 27.38,32.38 28.25,31.5 29.5,31.5 29.7,31.7 A20_OLINUXINO_LIME2_SHIELD.D-17
LCD0_D13  (via drill 0.3)
  Top 0.2: v27,31.75 27,32.5 25.75,33.75 25.75,39 21.75,43 X1.35
  Bottom 0.2: 25.5,31.75 25.55,31.7 A20_OLINUXINO_LIME2_SHIELD.D-18 26.95,31.7 v27,31.75
LCD0_D14  (via drill 0.3)
  Top 0.2: v27.5,33.62 27.5,38.25 22.75,43 X1.37
  Bottom 0.2: A20_OLINUXINO_LIME2_SHIELD.D-19 29.03,32.97 28.38,33.62 v27.5,33.62
LCD0_D15  (via drill 0.3)
  Top 0.2: v28.5,32.12 28.5,38.25 23.75,43 X1.39
  Bottom 0.25: A20_OLINUXINO_LIME2_SHIELD.D-20 27.65,32.97 v28.5,32.12
LCD0_D16  (via drill 0.3)
  Top 0.2: v28.25,25.25 29,26 29,38.5 24.25,43.25 X1.40
  Bottom 0.25: A20_OLINUXINO_LIME2_SHIELD.D-5 29.17,24.08 28.25,25 v28.25,25.25
LCD0_D17  (via drill 0.3)
  Top 0.2: v27.5,25.25 28.5,26.25 28.5,31.25 28,31.75 28,38.25 23.25,43 X1.38
  Bottom 0.4: A20_OLINUXINO_LIME2_SHIELD.D-6 26.83,24.08 27.5,24.75 v27.5,25.25
LCD0_D18  (via drill 0.3)
  Top 0.2: v28,26.75 28,31.25 27.5,31.75 27.5,32.5 26.25,33.75 26.25,39 22.25,43 X1.36
  Bottom 0.25: A20_OLINUXINO_LIME2_SHIELD.D-7 29.15,25.35 28,26.5 v28,26.75
LCD0_D19  (via drill 0.3)
  Top 0.2: v24.25,25.5 24.25,26.5 24.75,27 24.75,31.75 25.25,32.25 25.25,39 21.25,43 X1.34
  Bottom 0.2: A20_OLINUXINO_LIME2_SHIELD.D-8 24.4,25.35 v24.25,25.5
LCD0_D20  (via drill 0.3)
  Top 0.2: v24.25,27.25 24.25,31.75 24,32 24,39.25 20.25,43 X1.32
  Bottom 0.2: A20_OLINUXINO_LIME2_SHIELD.D-9 29.13,26.62 28.5,27.25 v24.25,27.25
LCD0_D21  (via drill 0.3)
  Top 0.2: v23.5,26.75 23.5,30.75 23.25,31 23.25,39 19.25,43 X1.30
  Bottom 0.2: A20_OLINUXINO_LIME2_SHIELD.D-10 25.13,26.62 25,26.75 v23.5,26.75
LCD0_D22  (via drill 0.3)
  Top 0.2: v23,28.5 23,30.5 22.25,31.25 22.25,39 18.25,43 X1.28
  Bottom 0.2: A20_OLINUXINO_LIME2_SHIELD.D-11 27.86,27.89 27.25,28.5 v23,28.5
LCD0_D23  (via drill 0.3)
  Top 0.2: v22.5,28 22,28.5 22,30 21.25,30.75 21.25,39 17.25,43 X1.26
  Bottom 0.2: A20_OLINUXINO_LIME2_SHIELD.D-12 25.61,27.89 25.5,28 v22.5,28
LCD0_DE  (via drill 0.3)
  Top 0.2: v14.5,39.25 11.25,42.5 X1.14
  Bottom 0.2: v14.5,39.25 15.5,40.25 20.75,40.25 21,40 24.25,40 24.84,40.59 A20_OLINUXINO_LIME2_SHIELD.D-32
LCD0_HSYNC  (via drill 0.3)
  Top 0.2: SJ1.1 15.5,31.75 16.5,32.75 17.5,32.75 18.5,33.75 v18.5,39.75 | v15.5,39.25 15.5,39.5 12.25,42.75 X1.16
  Bottom 0.2: A20_OLINUXINO_LIME2_SHIELD.D-29 27.43,39.32 26.75,40 24.75,40 24.25,39.5 21,39.5 20.75,39.75 v18.5,39.75 16,39.75 v15.5,39.25
LCD0_VSYNC  (via drill 0.3)
  Top 0.2: 17.85,32.35 19,33.5 v19,39.25 | v16.5,39.25 16.5,39.5 13.25,42.75 X1.18
  Top 0.3: SJ2.1 17.75,32.25 17.85,32.35
  Bottom 0.2: A20_OLINUXINO_LIME2_SHIELD.D-30 24.82,39.32 24.5,39 21,39 20.75,39.25 v19,39.25 v16.5,39.25
LCD1_DE/PH25  (via drill 0.3)
  Top 0.2: LSP1.MP v77.5,43.25
  Bottom 0.2: A20_OLINUXINO_LIME2_SHIELD.3-36 77.62,43.13 v77.5,43.25
LCD1_HSYNC/PH26  (via drill 0.3)
  Top 0.2: 15.5,27.5 15.75,27.25 15.65,27.25 SJ1.3 | v77.75,44 78,43.75 82.5,43.75 84.5,41.75
  Top 0.3: 84.5,41.75 84.5,30.5 82.75,28.75 55.75,28.75 43.75,16.75
  Top 0.4: 15.5,27.5 15.25,27.5 14.25,28.5 6.25,28.5 2.75,25 2.75,20.75 3,20.5 3,13.25 6.25,10 15,10 17.75,12.75 28.25,12.75 29.5,14 29.5,16 30.25,16.75 43.75,16.75
  Bottom 0.3: A20_OLINUXINO_LIME2_SHIELD.3-38 78.4,44.4 78.25,44.25 78,44.25 v77.75,44
LCD1_VSYNC/PH27  (via drill 0.3)
  Top 0.2: 5.88,20.38 7.62,20.38 8,20 8,18.5 7.62,18.12 5.38,18.12 5.25,18 | v80.5,43.25 82.25,43.25 84,41.5
  Top 0.3: 84,41.5 84,30.75 82.5,29.25 55.25,29.25 43.5,17.5
  Top 0.4: SJ2.3 17.75,26.75 16.88,25.88 14.38,25.88 13.25,27 6.75,27 4.25,24.5 4.25,22 5.88,20.38 | 5.25,18 4.25,17 4.25,13.25 6.75,10.75 14.75,10.75 17.5,13.5 28,13.5 28.75,14.25 28.75,16 30.25,17.5 43.5,17.5
  Bottom 0.2: A20_OLINUXINO_LIME2_SHIELD.3-40 79.83,45.67 80.25,45.25 80.25,43.5 v80.5,43.25
LDO3_2.8V/VCC_CSI0  (via drill 0.3)
  Top 0.4: R10.2 88.5,21 86.25,21
  Top 0.6: v70.75,15.25 70.75,13.5 72,12.25 77.5,12.25 86.25,21
  Bottom 0.3: A20_OLINUXINO_LIME2_SHIELD.2-4 71.33,15.82 v70.75,15.25
LINEINL
  Bottom 0.3: A20_OLINUXINO_LIME2_SHIELD.4-15 28.04,6.21 27.5,6.75 26.75,6.75 25.5,8 SV2.3
LINEINR
  Bottom 0.3: A20_OLINUXINO_LIME2_SHIELD.4-13 29.31,7.25 SV2.5
MICIN1
  Bottom 0.4: A20_OLINUXINO_LIME2_SHIELD.1-10 31.14,19.64 30.5,19 30.5,17.5 28.75,15.75 JP2.2
MICIN2  (via drill 0.3)
  Top 0.4: JP1.2 22.98,4.02 25.25,1.75 30.75,1.75 v31.75,2.75
  Bottom 0.4: A20_OLINUXINO_LIME2_SHIELD.4-10 31.85,2.65 v31.75,2.75
N$1
  Top 0.2: X5.4 48.25,40.75
  Top 0.25: 48.25,40.75 47.5,40 R6.1
N$2
  Top 0.2: X4.38 89.25,5.75 | X4.40 89.25,4.75
  Top 0.4: R7.2 88.25,4.75 | 88.25,4.75 89.25,5.75 | 88.25,4.75 89.25,4.75
N$3
  Top 0.2: X4.3 88.95,23.25 R10.1
N$4
  Bottom 0.2: 10.75,20.38 12.62,20.38 12.75,20.25
N$5
  Bottom 0.3: A20_OLINUXINO_LIME2_SHIELD.2-6 71.35,17.1 71,16.75 R8.2
N$9
  Bottom 0.3: A20_OLINUXINO_LIME2_SHIELD.2-8 71.18,18.37 R9.2
NDQS/PC24  (via drill 0.3)
  Top 0.2: X1.7 7.75,44.5 9,45.75 13.75,45.75 14.25,46.25 23,46.25 24.5,47.75 27.5,47.75 29.25,46 29.25,42.75 v31.75,40.25
  Bottom 0.2: A20_OLINUXINO_LIME2_SHIELD.1-38 31.58,37.42 31,38 31,39.75 31.5,40.25 v31.75,40.25
PWM0  (via drill 0.3)
  Top 0.2: v23.75,44.75 23.25,45.25 14.75,45.25 14.25,44.75 9.5,44.75 9.25,44.5 X1.10
  Bottom 0.2: A20_OLINUXINO_LIME2_SHIELD.D-36 24.12,43.13 23.75,43.5 v23.75,44.75
RESET_N  (via drill 0.3)
  Top 0.25: X4.33 92,8.25
  Top 0.3: v92.75,20.75 92.75,9 92,8.25
  Bottom 0.4: A20_OLINUXINO_LIME2_SHIELD.3-5 91.17,24.08 92.75,22.5 v92.75,20.75
SPI0_CS0/PC23  (via drill 0.3)
  Top 0.2: X1.8 8.25,44.5 9,45.25 14,45.25 14.5,45.75 23.25,45.75 24.75,47.25 27.25,47.25 28.75,45.75 28.75,42.25 v31.5,39.5
  Bottom 0.2: A20_OLINUXINO_LIME2_SHIELD.1-40 31.56,38.69 31.5,38.75 v31.5,39.5
TS1_ERR/CSI1_MLCK/SDC1_CLK/PG1  (via drill 0.3)
  Top 0.25: LSP4.MP 38.25,18.75 v38,18.5
  Bottom 0.25: A20_OLINUXINO_LIME2_SHIELD.1-7 37.87,18.37 v38,18.5
TVOUT0/VGA-G  (via drill 0.2)
  Top 0.3: v33.75,25.75 33.75,23.25 29.22,18.72 13.97,18.72 12.22,16.97 X2.2
  Bottom 0.3: A20_OLINUXINO_LIME2_SHIELD.1-20 33.51,25.98 v33.75,25.75
TVOUT1/VGA-B  (via drill 0.3)
  Top 0.3: v33.38,26.62 33.25,26.5 33.25,23.5 29,19.25 15,19.25 X2.3
  Bottom 0.3: A20_OLINUXINO_LIME2_SHIELD.1-22 32.74,27.26 v33.38,26.62
TVOUT2/VGA-R  (via drill 0.2)
  Top 0.3: v34,27.25 34.5,26.75 34.5,23.25 29.5,18.25 15.25,18.25 11.79,14.79 X2.1
  Bottom 0.3: A20_OLINUXINO_LIME2_SHIELD.1-24 32.72,28.53 v34,27.25
TVOUT3
  Bottom 0.3: A20_OLINUXINO_LIME2_SHIELD.4-3 35.66,6.09 35,6.75 33.85,6.75 SV2.6
TWI2_SCK/PB20  (via drill 0.3)
  Top 0.4: v33.25,33 33.25,32 33.5,31.75 33.5,27.75 32.75,27 32.75,25 28.25,20.5 v20.5,20.5
  Bottom 0.4: R4.1 19.5,22.45 19.5,22.5 19.45,22.45 T2.2 19.55,20.5 v20.5,20.5 | A20_OLINUXINO_LIME2_SHIELD.1-32 32.65,33.6 v33.25,33
TWI2_SDA/PB21  (via drill 0.3)
  Top 0.2: v34,32.25 34,28 35,27
  Top 0.3: 35,27 35,23 29.75,17.75 21.75,17.75 v20.25,16.25
  Bottom 0.2: A20_OLINUXINO_LIME2_SHIELD.1-30 33.91,32.34 v34,32.25
  Bottom 0.3: v20.25,16.25 19.55,16.25 R2.1
  Bottom 0.4: T1.2 19.45,15.85 R2.1
VCC  (via drill 0.3)
  Top 0.2: R6.2 42.95,40.05 42.25,40.75 42,40.75
  Top 0.25: SV1.7 92.27,41.27 91,40 91,37.48 SV1.4 | 75.75,16 v75.5,16.25
  Top 0.4: v82,23.25 82.5,23.25 83,22.75
  Top 0.6: v84.75,23 83.25,23 83,22.75 82.75,22.5 82.75,20.25 v78.5,16 75.75,16 | v37,9.25 37,14.25 37.75,15 v38.5,15 | R7.1 88.25,2 89.25,1
  Top 0.8: 94,32.25 94,44 90.5,47.5 43,47.5 42,46.5 42,40.75 35,33.75 34.75,33.75 | v34.75,28.25 34.75,33.75 | 34.75,33.75 32.75,33.75 32.5,33.5 32.5,28 31.75,27.25 31.75,25.5 29.5,23.25 v28.25,23.25 28,23.5 26,23.5 25.75,23.25 v17.75,23.25
  Top 1: SV1.4 88.71,36.21 87.75,35.25 87.75,31.5 | 87.75,31.5 93.25,31.5 | 93.25,31.5 94,32.25 | v38.5,15 45,15 57.25,27.25 84.75,27.25 84.75,26.75 | 89.25,1 94.25,1 94.75,1.5 v94.75,27.25 | 93.25,31.5 94.75,30 v94.75,29.75 | v84.75,23 84.75,26.75 | 84.75,26.75 87.75,29.75 87.75,31.5
  Bottom 0.2: 30.88,23.25 31,23.38 31,24 31.12,24.12
  Bottom 0.25: 31.12,24.12 33.88,24.12 | A20_OLINUXINO_LIME2_SHIELD.2-3 75.92,15.82 v75.5,16.25
  Bottom 0.3: 34.75,22.75 34.69,22.81 A20_OLINUXINO_LIME2_SHIELD.D-3 30.44,22.81 30.88,23.25 | 33.88,24.12 34,24
  Bottom 0.4: T1.1 17.55,15.85 R2.2 17.7,16.2 18.5,17 19.25,17 19.5,17.25 19.5,18.75 19,19.25 18.7,19.25 T2.1 17.55,22.1 R4.2 17.7,23.2 v17.75,23.25 | A20_OLINUXINO_LIME2_SHIELD.D-3 28.69,22.81 v28.25,23.25 | A20_OLINUXINO_LIME2_SHIELD.4-1 36.93,9.18 v37,9.25 | A20_OLINUXINO_LIME2_SHIELD.3-3 82.44,22.81 v82,23.25 | A20_OLINUXINO_LIME2_SHIELD.1-3 37.67,15.82 v38.5,15
  Bottom 0.6: A20_OLINUXINO_LIME2_SHIELD.3-3 84.56,22.81 v84.75,23 | A20_OLINUXINO_LIME2_SHIELD.2-3 78.33,15.82 v78.5,16 | A20_OLINUXINO_LIME2_SHIELD.1-3 35.42,15.82 34.75,16.5 34.75,22.75 34.75,24 | 34.75,24 v34.75,28.25 | 34,24 34.75,24
  Bottom 1: v94.75,27.25 v94.75,29.75
VGA-HSYNC
  Top 0.4: SJ1.2 16.75,27.75 16.75,26.75 16.5,26.5 14.75,26.5 13.5,27.75 6.5,27.75 3.5,24.75 3.5,21.25 5.5,19.25 X2.13
VGA-VSYNC
  Top 0.4: X2.14 5.96,21.54 5,22.5 5,24.25 7,26.25 13,26.25 14,25.25 17.5,25.25 19,26.75 19,28.75 18.75,29 SJ2.2

### Text on the board
tPlace: LCD0 | CSI1 | JTAG0 | VGA | CSI0 | LIME2_ADAPTER / REV.0